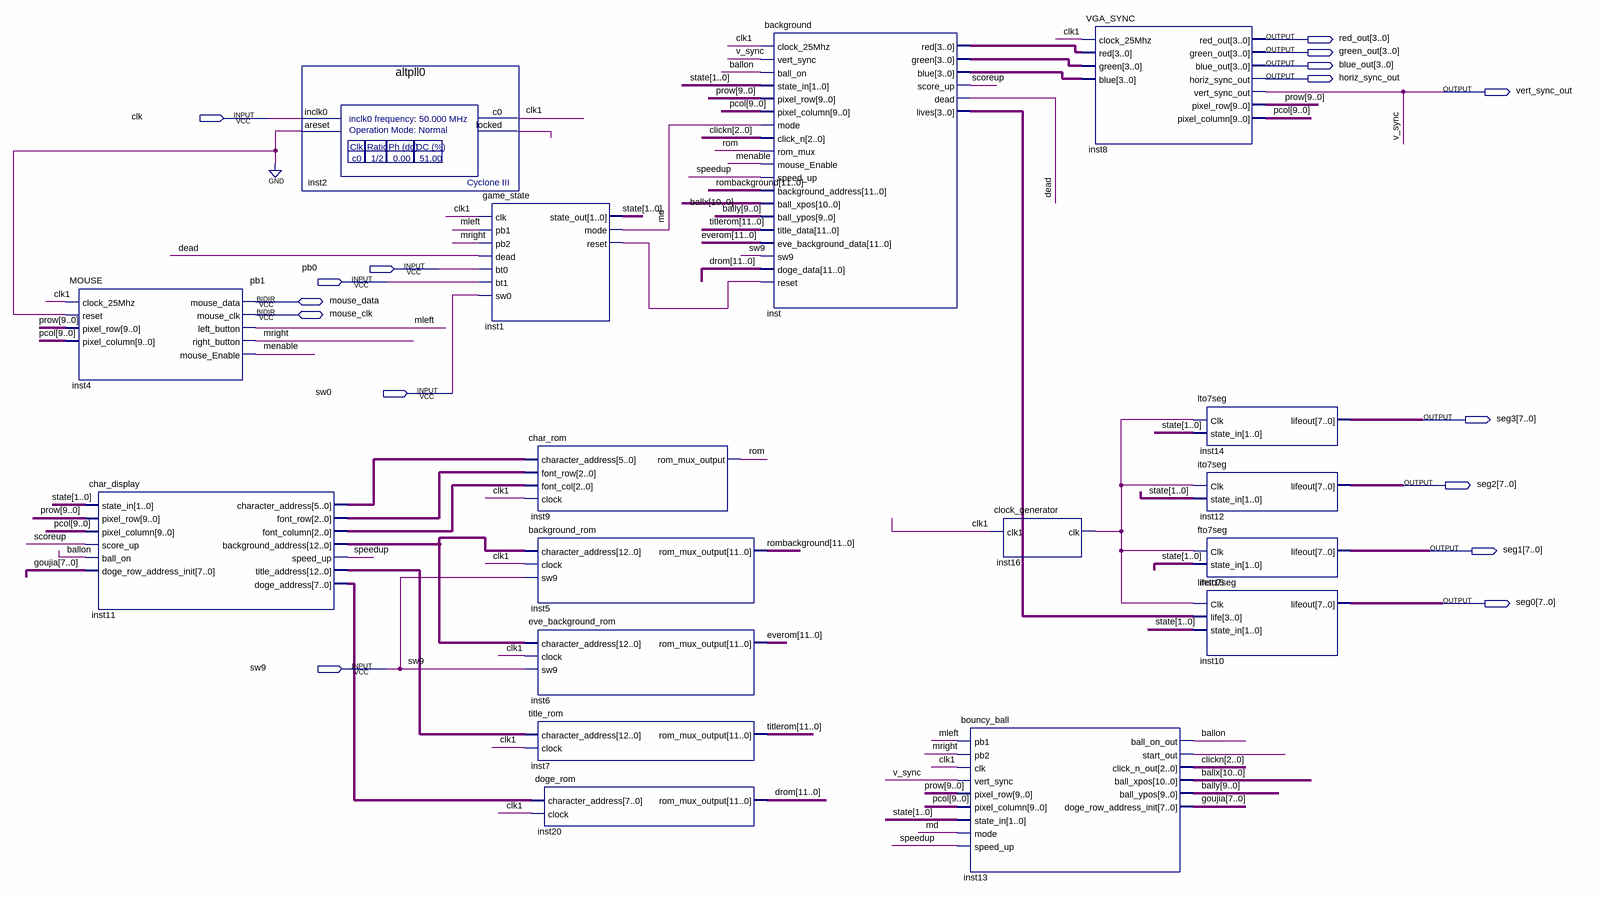
[diagram p0: schematic sheet]
// Quartus schematic VGA.bdf as structural Verilog: 17 symbols, 16 pins
module VGA (
  input  clk,
  input  pb0,
  input  pb1,
  input  sw0,
  input  sw9,
  inout  mouse_data,
  inout  mouse_clk,
  output [3:0] red_out,
  output [3:0] green_out,
  output [3:0] blue_out,
  output horiz_sync_out,
  output vert_sync_out,
  output [7:0] seg3,
  output [7:0] seg2,
  output [7:0] seg1,
  output [7:0] seg0
);

  wire ballon, clk1, dead, inst1_reset, inst2_locked, inst13_start_out, inst16_clk, md, menable, mleft,
       mright, rom, scoreup, speedup;
  wire [1:0] state;
  wire [2:0] clickn, inst11_font_column, inst11_font_row;
  wire [3:0] inst_blue, inst_green, inst_lives, inst_red;
  wire [5:0] inst11_character_address;
  wire [7:0] goujia, inst11_doge_address;
  wire [9:0] bally, pcol, prow;
  wire [10:0] ballx;
  wire [11:0] drom, everom, rombackground, titlerom;
  wire [12:0] inst11_background_address, inst11_title_address;

  MOUSE inst4 (
    .clock_25Mhz(clk1), .reset(1'b0), .pixel_row(prow), .pixel_column(pcol), .left_button(mleft),
    .right_button(mright), .mouse_Enable(menable), .mouse_data(mouse_data), .mouse_clk(mouse_clk));
  char_display inst11 (
    .state_in(state), .pixel_row(prow), .pixel_column(pcol), .score_up(scoreup), .ball_on(ballon),
    .doge_row_address_init(goujia), .character_address(inst11_character_address), .font_row(inst11_font_row),
    .font_column(inst11_font_column), .background_address(inst11_background_address), .speed_up(speedup),
    .title_address(inst11_title_address), .doge_address(inst11_doge_address));
  altpll0 inst2 (.inclk0(clk), .areset(1'b0), .c0(clk1), .locked(inst2_locked));
  game_state inst1 (
    .clk(clk1), .pb1(mleft), .pb2(mright), .dead(dead), .bt0(pb0), .bt1(pb1), .sw0(sw0), .state_out(state),
    .mode(md), .reset(inst1_reset));
  char_rom inst9 (
    .character_address(inst11_character_address), .font_row(inst11_font_row), .font_col(inst11_font_column),
    .clock(clk1), .rom_mux_output(rom));
  background_rom inst5 (
    .character_address(inst11_background_address), .clock(clk1), .sw9(sw9), .rom_mux_output(rombackground));
  eve_background_rom inst6 (
    .character_address(inst11_background_address), .clock(clk1), .sw9(sw9), .rom_mux_output(everom));
  title_rom inst7 (.character_address(inst11_title_address), .clock(clk1), .rom_mux_output(titlerom));
  doge_rom inst20 (.character_address(inst11_doge_address), .clock(clk1), .rom_mux_output(drom));
  background inst (
    .clock_25Mhz(clk1), .vert_sync(vert_sync_out), .ball_on(ballon), .state_in(state), .pixel_row(prow),
    .pixel_column(pcol), .mode(md), .click_n(clickn), .rom_mux(rom), .mouse_Enable(menable),
    .speed_up(speedup), .background_address(rombackground), .ball_xpos(ballx), .ball_ypos(bally),
    .title_data(titlerom), .eve_background_data(everom), .sw9(sw9), .doge_data(drom), .reset(inst1_reset),
    .red(inst_red), .green(inst_green), .blue(inst_blue), .score_up(scoreup), .dead(dead), .lives(inst_lives));
  bouncy_ball inst13 (
    .pb1(mleft), .pb2(mright), .clk(clk1), .vert_sync(vert_sync_out), .pixel_row(prow), .pixel_column(pcol),
    .state_in(state), .mode(md), .speed_up(speedup), .ball_on_out(ballon), .start_out(inst13_start_out),
    .click_n_out(clickn), .ball_xpos(ballx), .ball_ypos(bally), .doge_row_address_init(goujia));
  clock_generator inst16 (.clk1(clk1), .clk(inst16_clk));
  VGA_SYNC inst8 (
    .clock_25Mhz(clk1), .red(inst_red), .green(inst_green), .blue(inst_blue), .red_out(red_out),
    .green_out(green_out), .blue_out(blue_out), .horiz_sync_out(horiz_sync_out),
    .vert_sync_out(vert_sync_out), .pixel_row(prow), .pixel_column(pcol));
  lto7seg inst14 (.Clk(inst16_clk), .state_in(state), .lifeout(seg3));
  ito7seg inst12 (.Clk(inst16_clk), .state_in(state), .lifeout(seg2));
  fto7seg inst15 (.Clk(inst16_clk), .state_in(state), .lifeout(seg1));
  lifeto7seg inst10 (.Clk(inst16_clk), .life(inst_lives), .state_in(state), .lifeout(seg0));

  // Other names for the same wires on the sheet: v_sync = vert_sync_out
endmodule
